# Altium schematic sheet ANALOG_SWITCH.SchDoc: ANALOG SWITCH
size A3; Author: Silvio Navaretti; CompanyName: ARDUINO; DrawnBy: Silvio Navaretti; Engineer: Silvio Navaretti; Organization: ARDUINO; SheetNumber: 17; SheetTotal: 51; RevAuthor: Silvio Navaretti
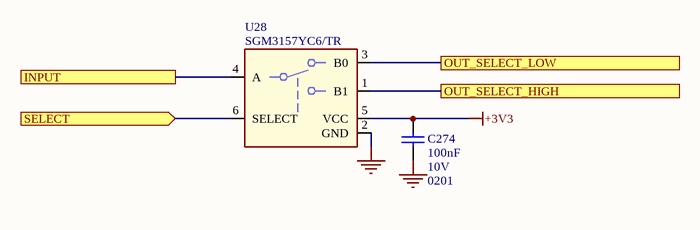
[diagram p0: ANALOG_SWITCH.SchDoc]

## Parts
C274  value 100nF  Voltage: 10V  Case Code (Imperial): 0201  [CAP-0201]  (hidden comment: CL03A104KP3NNNC)
U28  SGM3157YC6/TR  [TSOP65P210X110-6N]

## Ports
INPUT, OUT_SELECT_HIGH, OUT_SELECT_LOW, SELECT (in)

## Nets
+3V3: C274.2 U28.5(VCC)
GND: C274.1 U28.2(GND)
INPUT: U28.4(A) ; port INPUT
OUT_SELECT_HIGH: U28.1(B1) ; port OUT_SELECT_HIGH
OUT_SELECT_LOW: U28.3(B0) ; port OUT_SELECT_LOW
SELECT: U28.6(SELECT) ; port SELECT

## Notes on the sheet
- Title:
- ID:
- Date:
- Time:
- Version:
- Sheet
- of
- RevAuthor:
- Reference Designs ARE PROVIDED "AS IS" AND "WITH ALL FAULTS. Arduino SA DISCLAIMS ALL OTHER WARRANTIES, EXPRESS OR IMPLIED, REGARDING PRODUCTS, INCLUDING BUT NOT LIMITED TO, ANY IMPLIED WARRANTIES OF MERCHANTABILITY OR FITNESS FOR A PARTICULAR PURPOSE.
  Arduino SA may make changes to specifications and product descriptions at any time, without notice. The Customer must not rely on the absence or characteristics of any features or instructions marked "reserved" or "undefined".
  Arduino SA reserves these for future definition and shall have no responsibility whatsoever for conflicts or incompatibilities arising from future changes to them. The product information on the Web Site or Materials is subject to change without notice.
  Do not finalize a design with this info. ARDUINO and other Arduino brands and logos and Trademarks of Arduino SA. All Arduino SA Trademarks cannot be used without owner's formal permission.
- File:
- Author:

## Library data of the parts
C274 = C0113-A.6: CAP CHIP 0201 100nF 10% 10V X5R; Manufacturer: Samsung Electro-Mechanics; Code Arduino: C0113; Technology: Ceramic; Part Number: CL03A104KP3NNNC; Dielectric: X5R; Tolerance: 10%
U28 = U0174-A.3: IC SPDT,max 25R at VCC 4.5V tPD 1.2ns VCC 1.65V to 5V Iq max 10uA SOT363; Manufacturer: SG Micro; Code Arduino: U0174; Part Number: SGM3157YC6/TR; Manufacturer 2: ON Semiconductor; Part Number 2: NLASB3157DFT2G